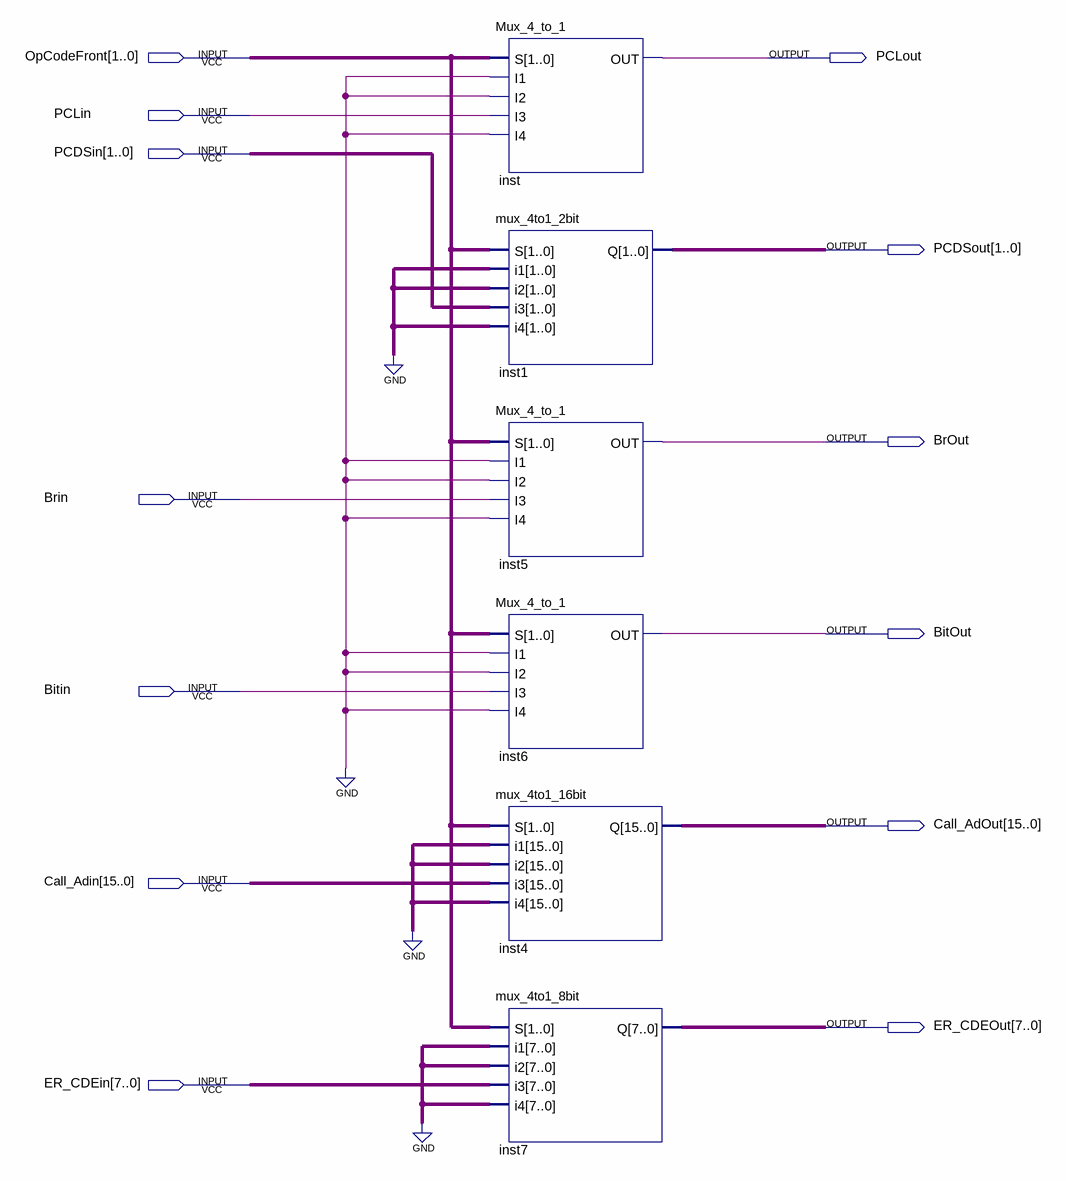
[diagram p0: schematic sheet]
// Quartus schematic PC_Interact_Enable.bdf as structural Verilog: 6 symbols, 13 pins
module PC_Interact_Enable (
  input  [1:0] OpCodeFront,
  input  PCLin,
  input  [1:0] PCDSin,
  input  Brin,
  input  Bitin,
  input  [15:0] Call_Adin,
  input  [7:0] ER_CDEin,
  output PCLout,
  output [1:0] PCDSout,
  output BrOut,
  output BitOut,
  output [15:0] Call_AdOut,
  output [7:0] ER_CDEOut
);

  Mux_4_to_1 inst (.S(OpCodeFront), .I1(1'b0), .I2(1'b0), .I3(PCLin), .I4(1'b0), .OUT(PCLout));
  mux_4to1_2bit inst1 (.S(OpCodeFront), .i1(2'b00), .i2(2'b00), .i3(PCDSin), .i4(2'b00), .Q(PCDSout));
  Mux_4_to_1 inst5 (.S(OpCodeFront), .I1(1'b0), .I2(1'b0), .I3(Brin), .I4(1'b0), .OUT(BrOut));
  Mux_4_to_1 inst6 (.S(OpCodeFront), .I1(1'b0), .I2(1'b0), .I3(Bitin), .I4(1'b0), .OUT(BitOut));
  mux_4to1_16bit inst4 (
    .S(OpCodeFront), .i1({16{1'b0}}), .i2({16{1'b0}}), .i3(Call_Adin), .i4({16{1'b0}}), .Q(Call_AdOut));
  mux_4to1_8bit inst7 (.S(OpCodeFront), .i1({8{1'b0}}), .i2({8{1'b0}}), .i3(ER_CDEin), .i4({8{1'b0}}), .Q(ER_CDEOut));
endmodule
